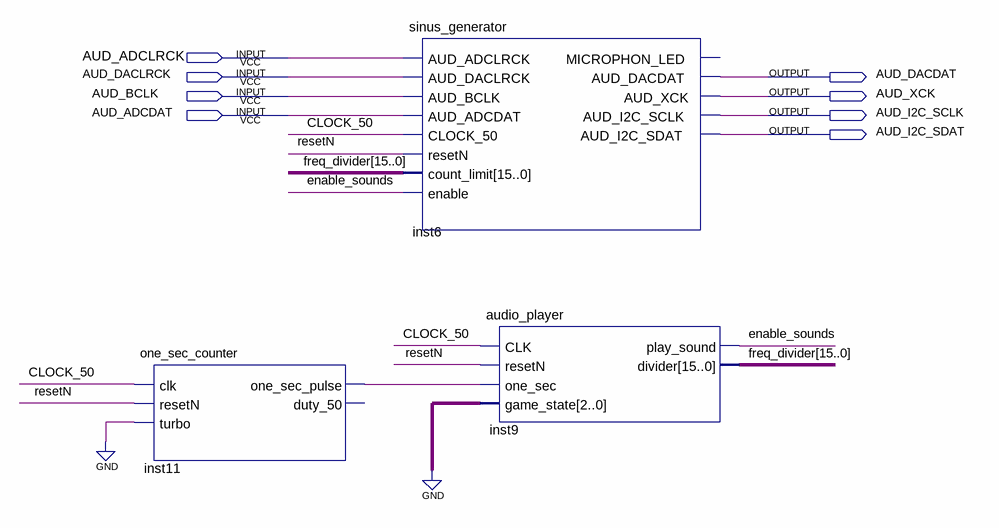
[diagram p0: schematic sheet]
// Quartus schematic tmp_audio_integ.bdf as structural Verilog: 3 symbols, 8 pins
module tmp_audio_integ (
  input  AUD_ADCLRCK,
  input  AUD_DACLRCK,
  input  AUD_BCLK,
  input  AUD_ADCDAT,
  output AUD_DACDAT,
  output AUD_XCK,
  output AUD_I2C_SCLK,
  output AUD_I2C_SDAT
);

  wire CLOCK_50, enable_sounds, inst11_one_sec_pulse, resetN;
  wire [15:0] freq_divider;

  one_sec_counter inst11 (
    .clk(CLOCK_50), .resetN(resetN), .turbo(1'b0), .one_sec_pulse(inst11_one_sec_pulse));  // open: duty_50
  sinus_generator inst6 (
    .AUD_ADCLRCK(AUD_ADCLRCK), .AUD_DACLRCK(AUD_DACLRCK), .AUD_BCLK(AUD_BCLK), .AUD_ADCDAT(AUD_ADCDAT),
    .CLOCK_50(CLOCK_50), .resetN(resetN), .count_limit(freq_divider), .enable(enable_sounds),
    .AUD_DACDAT(AUD_DACDAT), .AUD_XCK(AUD_XCK), .AUD_I2C_SCLK(AUD_I2C_SCLK), .AUD_I2C_SDAT(AUD_I2C_SDAT));  // open: MICROPHON_LED
  audio_player inst9 (
    .CLK(CLOCK_50), .resetN(resetN), .one_sec(inst11_one_sec_pulse), .game_state(3'b000),
    .play_sound(enable_sounds), .divider(freq_divider));
endmodule
